# EasyEDA schematic weathermon_v1.json
TITLE: ARD_Node_1; REV: 1.0; Date: 2021-02-15; Sheet: 1/1; Drawn By: arachnothrone; Company: Your Company
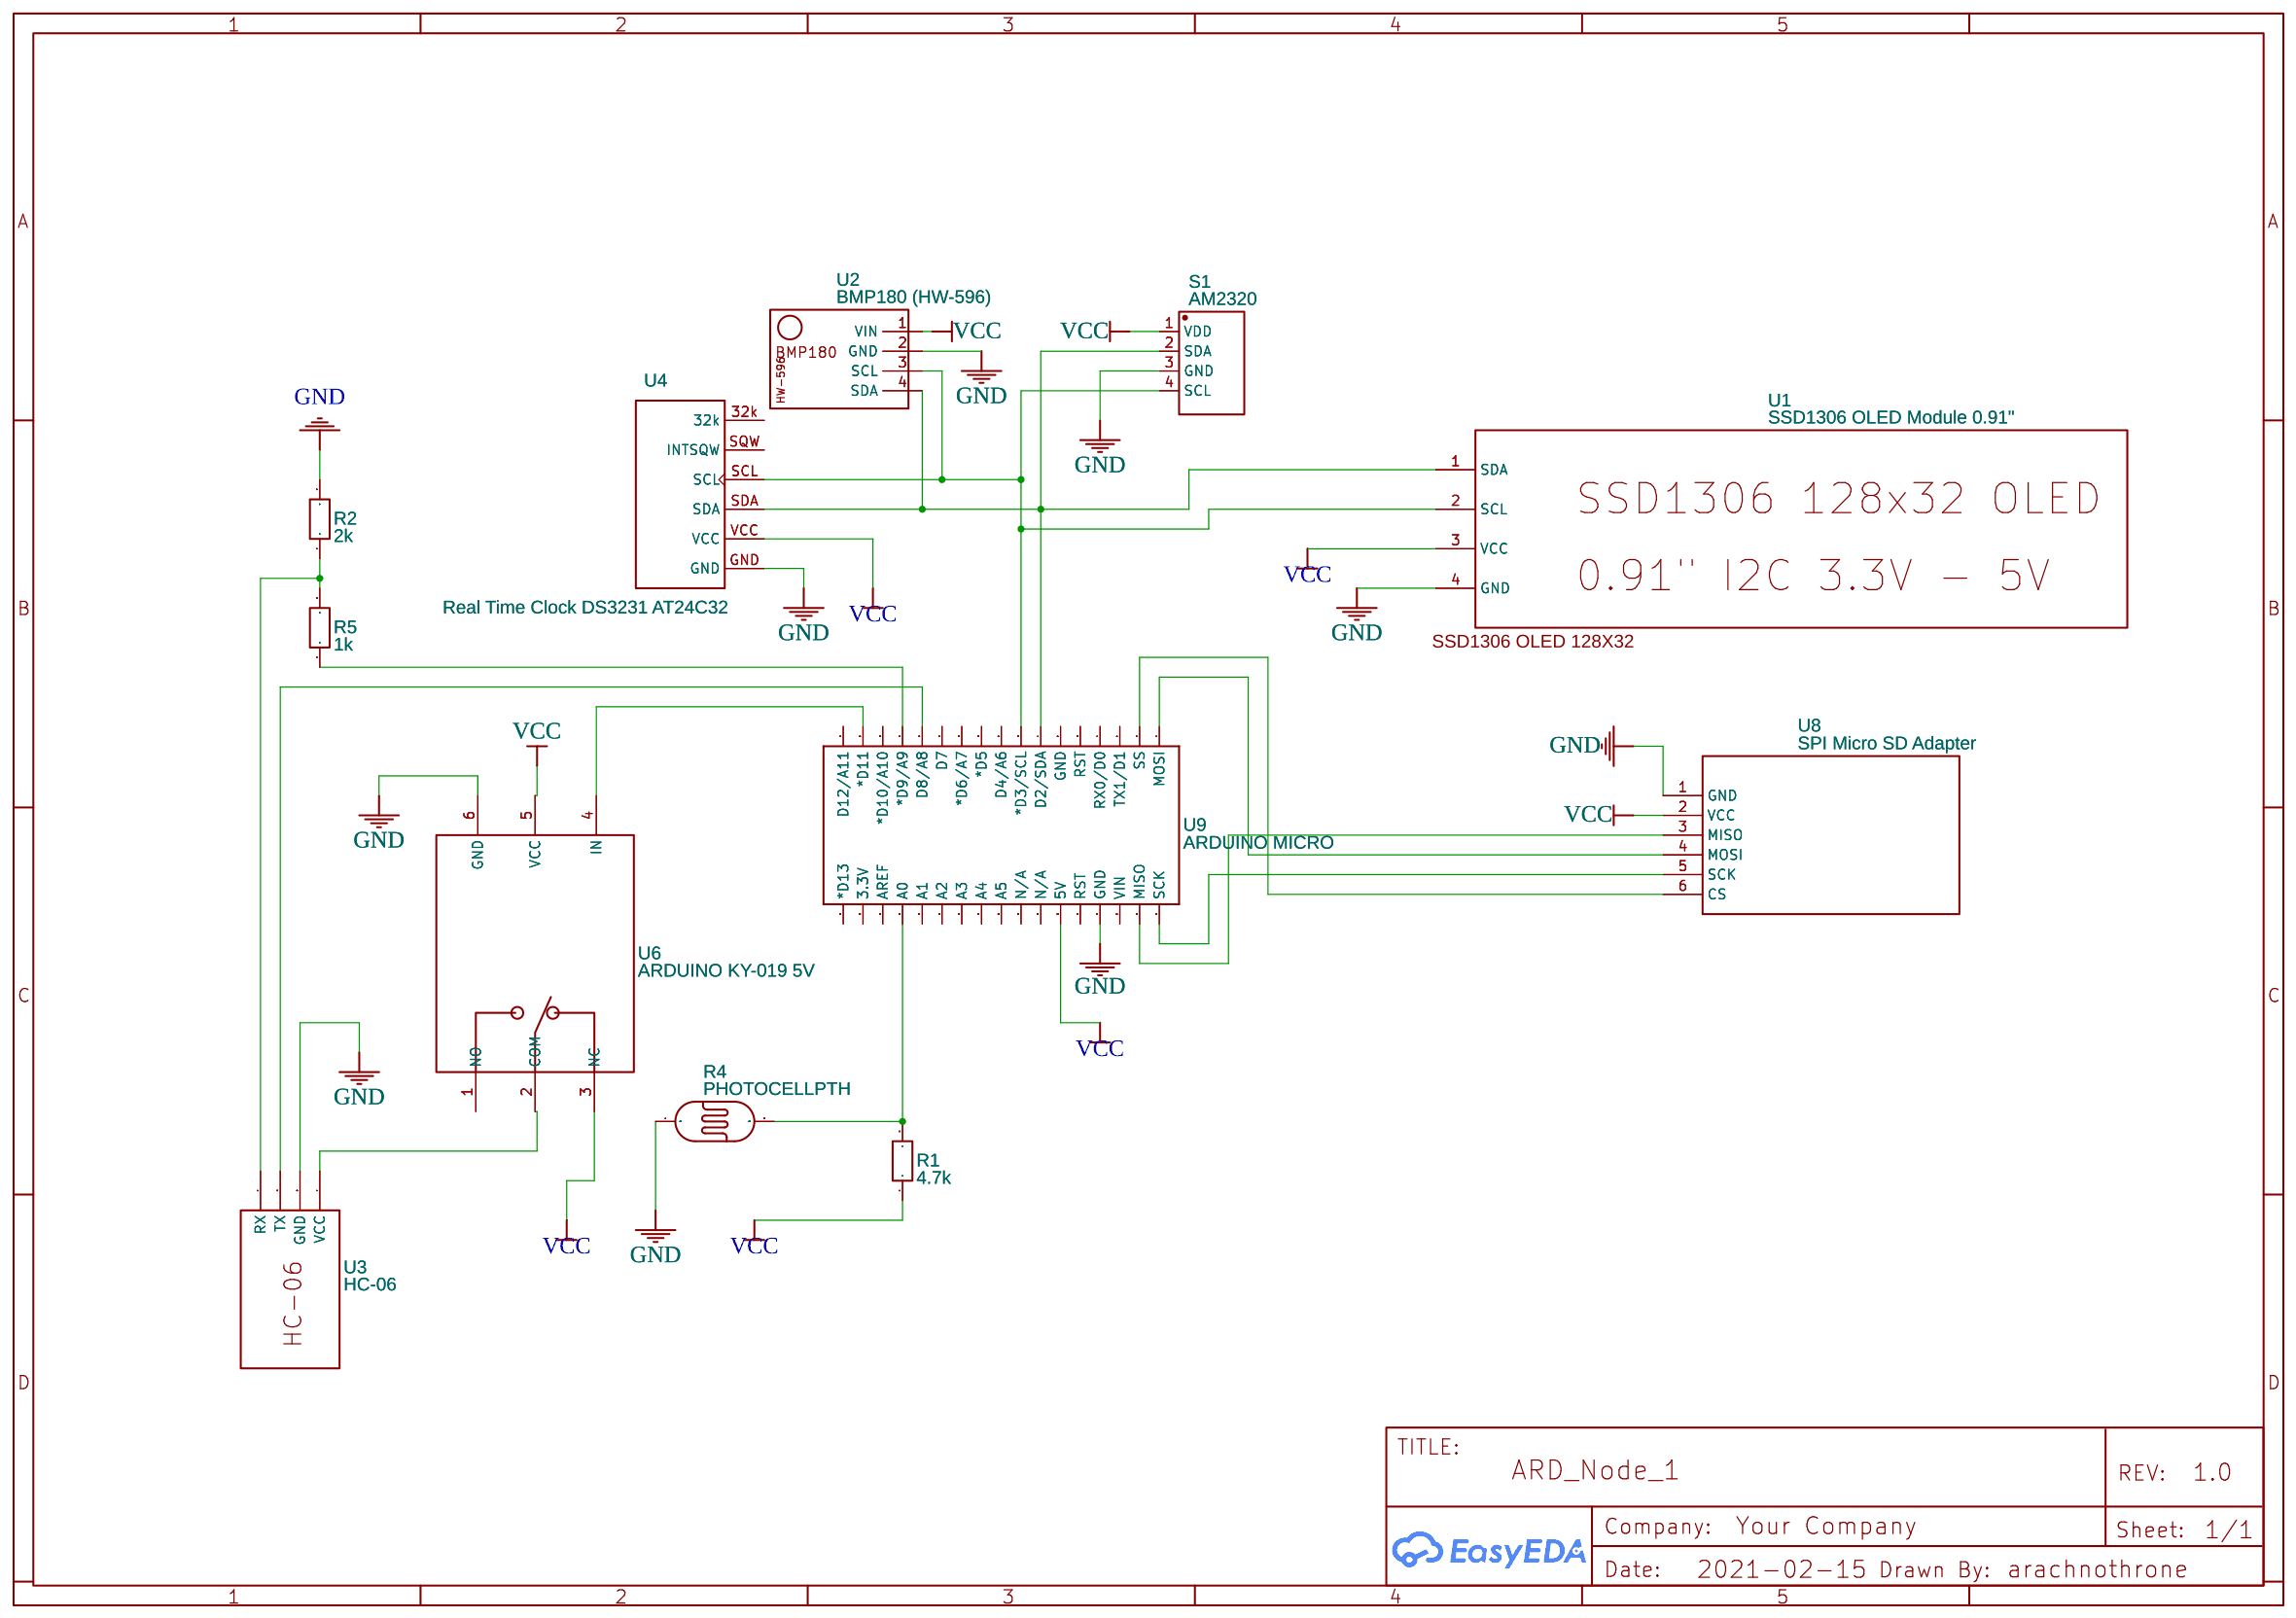
[diagram p0: schematic sheet]

## Parts
R1  4.7k  [R0603]
R2  2k  [R0603]
R4  PHOTOCELLPTH  [PHOTOCELL]
R5  1k  [R0603]
S1  AM2320  [SENSOR-TH_AM2320]
U1  SSD1306 OLED Module 0.91"  [SSD1306 OLED 128X32]
U2  BMP180 (HW-596)  [BMP180 (HW-596) MODIFIED SIZE]
U3  HC-06  [HC-06]
U4  Real Time Clock DS3231 AT24C32  [REAL TIME CLOCK ARI]
U6  ARDUINO KY-019 5V  [ARDUINO RELAY KY-019 5V]
U8  SPI Micro SD Adapter  [SPI MICRO SD_ADAPTER]
U9  ARDUINO MICRO  [ARDUINO MICRO]

## Library data of the parts
R1 R2 R5 = R_0603_EU: Contributor: LCEDA_Lib
R4 = PHOTOCELLPTH: CdS photoresistor. This is a low cost way to detect light levels. Resistance decreases with more incoming light. SparkFun SKU: SEN-09088; Contributor: SparkFun
S1 = AM2320: Supplier: LCSC; Manufacturer: AOSONG; Supplier Part: C87932; LCSC Assembly: Yes; SMT Type: Extend
U1 = SSD1306 OLED Module 0.91": Manufacturer Part: SSD1306 0.91; link: https://www.ebay.co.uk/itm/1PCS-DC-3-3v-5v-IIC-0-91-128x32-White-OLED-Display-OLED-Module-SSD1306/283031502950?hash=item41e5fe0066:g:7n8AAOSw3jtbNhE5; Contributor: macpad; Package Display: Yes
U2 = BMP180 (HW-596): Contributor: atikkur
U3 = HC-06: Contributor: nico.hampl1999; sourceId: 31jdvN5mE
U4 = Real Time Clock DS3231 AT24C32: +-5ppm, I2C Real-Time Clock with Internal MEMs Resonator, 8-Pin SO, -40 to 85 degC, Automotive Qualified, Pb-Free, Reel
U6 = ARDUINO KY-019 5V: Manufacturer Part: SRD-05VDC-SL-C; Contributor: Артем Лобач; Supplier Part: undefined; Supplier: eBay
U8 = SPI Micro SD Adapter: Contributor: alapsker
U9 = ARDUINO MICRO: sourceId: p30K6scyh

## Nets
GND: R2.2 R4.1(P$1) S1.3(GND) U1.4(GND) U2.2(GND) U3.3(GND) U4.GND U6.6(GND) U8.1(GND) U9.31(GND)
VCC: R1.1 S1.1(VDD) U1.3(VCC) U2.1(VIN) U4.VCC U6.3(NC) U6.5(VCC) U8.2(VCC) U9.29(5V)
Net-(R1-2): R1.2 R4.2(P$2) U9.21(A0)
Net-(R2-1): R2.1 R5.2 U3.1(RX)
Net-(R5-1): R5.1 U9.14(*D9/A9)
Net-(S1-2): S1.2(SDA) U1.1(SDA) U2.4(SDA) U4.SDA U9.7(D2/SDA)
Net-(S1-4): S1.4(SCL) U1.2(SCL) U2.3(SCL) U4.SCL U9.8(*D3/SCL)
Net-(U3-2): U3.2(TX) U9.13(D8/A8)
Net-(U3-4): U3.4(VCC) U6.2(COM)
Net-(U6-4): U6.4(IN) U9.16(*D11)
Net-(U8-3): U8.3(MISO) U9.33(MISO)
Net-(U8-4): U8.4(MOSI) U9.1(MOSI)
Net-(U8-5): U8.5(SCK) U9.34(SCK)
Net-(U8-6): U8.6(CS) U9.2(SS)

Not connected (* = marked no-connect by the designer): U4 32k SQW(INTSQW); U6 1(NO); U9 3(TX1/D1) 4(RX0/D0) 5(RST) 6(GND) 9(D4/A6) 10(*D5) 11(*D6/A7) 12(D7) 15(*D10/A10) 17(D12/A11) 18(*D13) 19(3.3V) 20(AREF) 22(A1) 23(A2) 24(A3) 25(A4) 26(A5) 27(N/A) 28(N/A) 30(RST) 32(VIN)
